# EAGLE design INTP009  product (EAGLE 9.6.2)
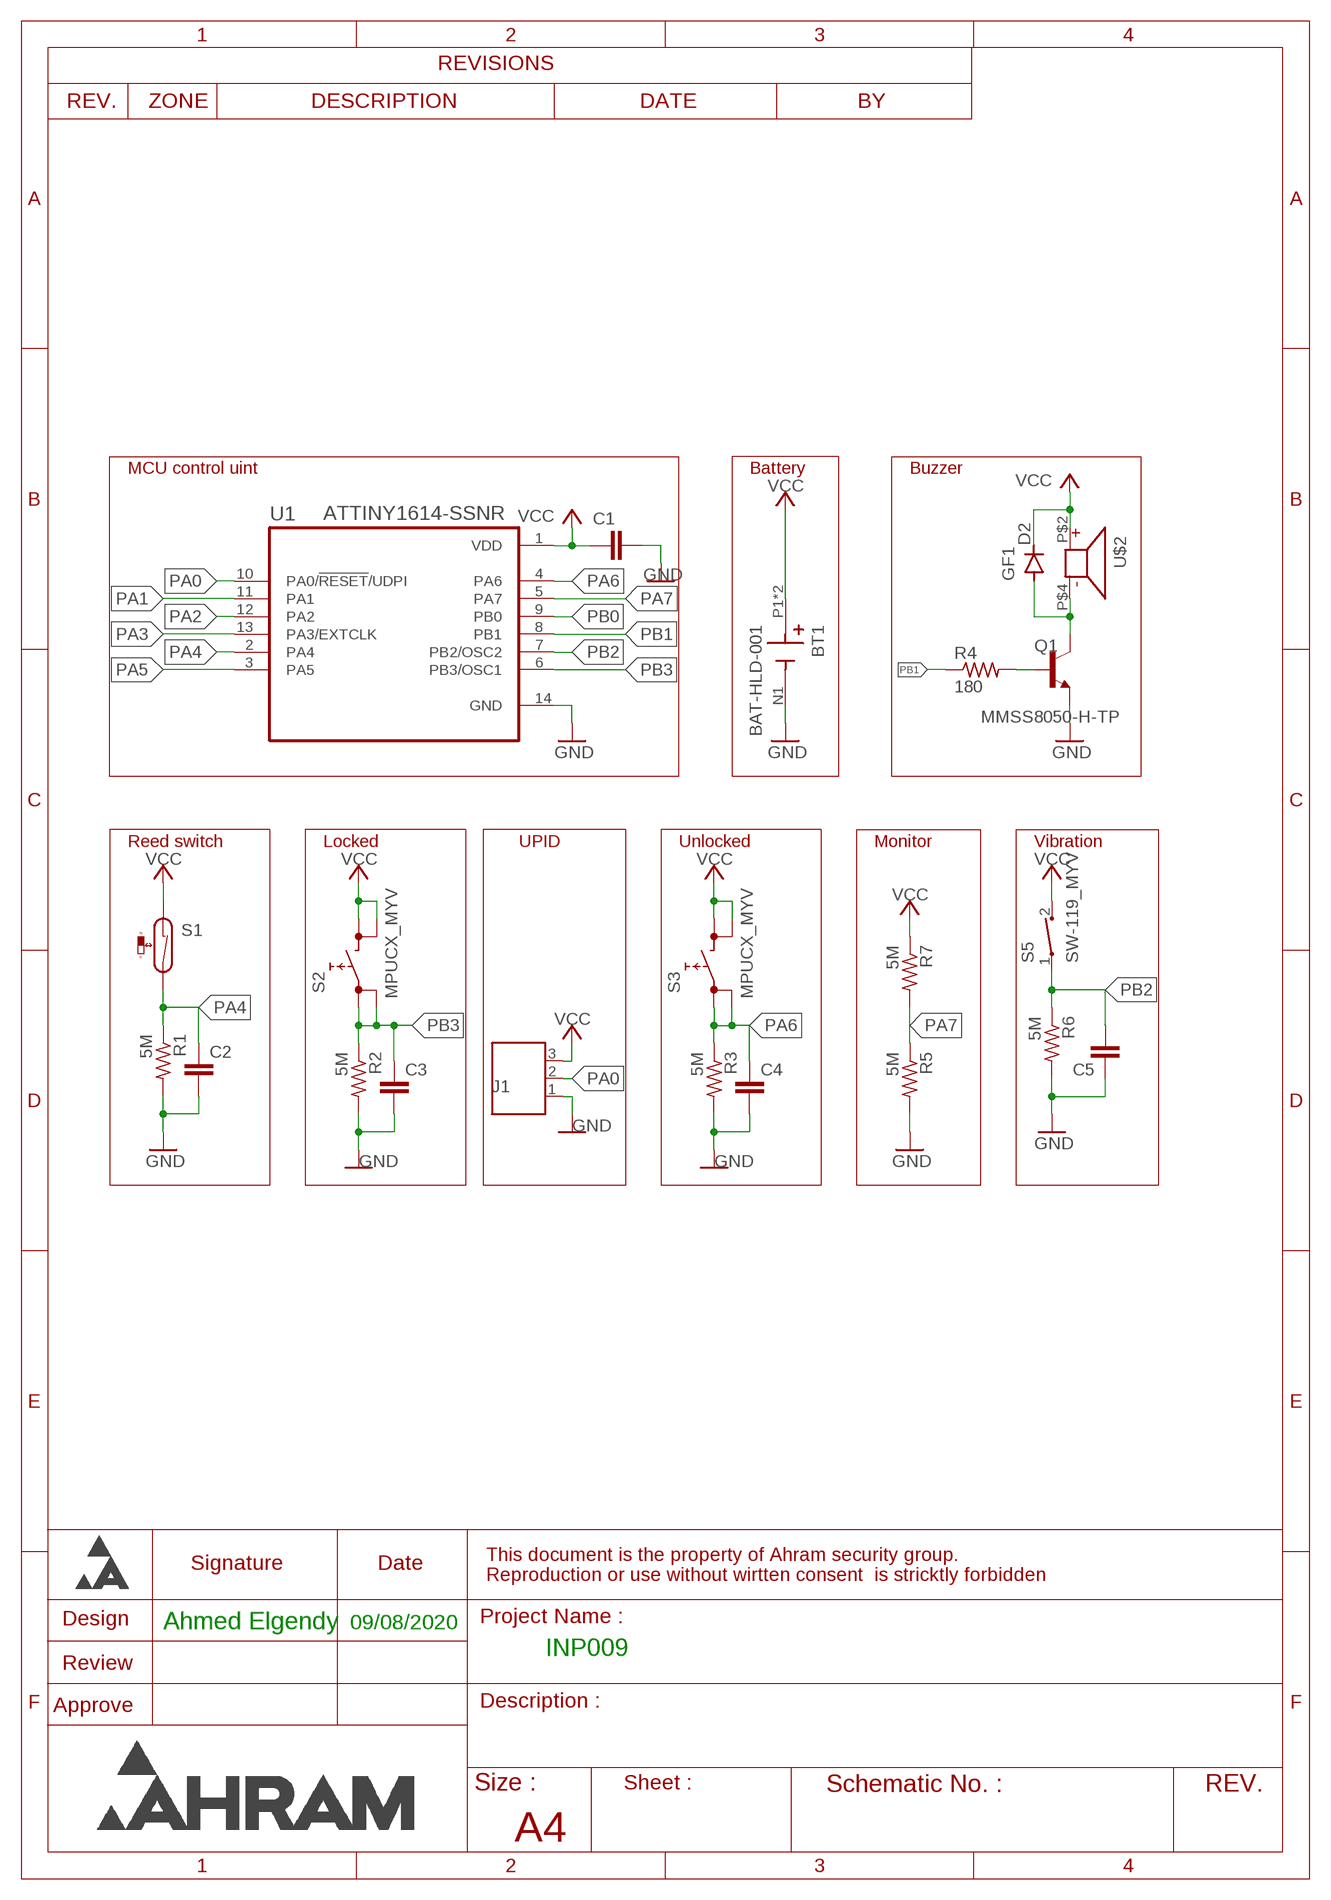
[diagram p0: schematic, sheet 1]

## Parts
BT1  BAT-HLD-001  [BAT_BAT-HLD-001]
C1  C-EUC0805K  [C0805K]
C2  C-EUC0805K  [C0805K]
C3  C-EUC0805K  [C0805K]
C4  C-EUC0805K  [C0805K]
C5  C-EUC0805K  [C0805K]
D2  GF1  [SMA-DO214AC]
J1  691508110303  [691508110303]
Q1  MMSS8050-H-TP  [TRANS_MMSS8050-H-TP]
R1  5M  R-US_M0805  [M0805]
R2  5M  R-US_M0805  [M0805]
R3  5M  R-US_M0805  [M0805]
R4  180  R-US_M0805  [M0805]
R5  5M  R-US_M0805  [M0805]
R6  5M  R-US_M0805  [M0805]
R7  5M  R-US_M0805  [M0805]
S1  RI80SMDM-MYV  [RI80SMDM-0510-J1]
S2  MPUCX_MYV  [MPUCX_MYV]
S3  MPUCX_MYV  [MPUCX_MYV]
S5  SW-119_MYV  [SW-119]
U1  ATTINY1614-SSNR  [SOIC127P600X175-14N]
U$2  ST-A03BH_MYV  [ST-A03BH_MYV]

## Nets
GND: BT1.N1(-) C1.2 C2.2 C3.2 C4.2 C5.1 J1.1 Q1.2(E) R1.2 R2.2 R3.2 R5.2 R6.2 U1.14(GND)
N$2: D2.A Q1.3(C) U$2.P$4
N$4: Q1.1(B) R4.2
PA0: J1.2 U1.10(PA0/!RESET!/UDPI)
PA1: U1.11(PA1)
PA2: U1.12(PA2)
PA3: U1.13(PA3/EXTCLK)
PA4: C2.1 R1.1 S1.P$2 U1.2(PA4)
PA5: U1.3(PA5)
PA6: C4.1 R3.1 S3.1 S3.2 U1.4(PA6)
PA7: R5.1 R7.2 U1.5(PA7)
PB0: U1.9(PB0)
PB1: R4.1 U1.8(PB1)
PB2: C5.2 R6.1 S5.1 U1.7(PB2/OSC2)
PB3: C3.1 R2.1 S2.1 S2.2 U1.6(PB3/OSC1)
VCC: BT1.P1(+) BT1.P2(+) C1.1 D2.K(C) J1.3 R7.1 S1.P$1 S2.3 S2.4 S3.3 S3.4 S5.2 U1.1(VDD) U$2.P$2

## Notes on the sheet
- MCU control uint | Battery | Buzzer
- Reed switch | Locked | UPID | Unlocked | Monitor | Vibration
- Ahmed Elgendy | 09/08/2020
- INP009

## Library data of the parts
BT1 = BAT-HLD-001:BAT-HLD-001: Battery Retainer Coin, 20.0mm 1 Cell SMD (SMT) Tab Buy Part <https://snapeda.com/parts/BAT-HLD-001/Linx%20Technologies/view-part/?ref=eda>; AVAILABILITY: Good; DESCRIPTION: Battery Holder 1 Cells Phosphor Bronze Bulk; DIGIKEY-PURCHASE-URL: https://snapeda.com/shop?store=DigiKey&id=184402; MF: Linx Technologies; MOUSER-PURCHASE-URL: https://snapeda.com/shop?store=Mouser&id=184402; MP: BAT-HLD-001; PACKAGE: None; PRICE: None
C1-C5 = rcl:C-EU: CAPACITOR, European symbol; SPICEPREFIX: C
D2 = diode:GF1: DIODE
J1 = Wurth_Elektronik_Electromechanic_Terminal_Blocks_Connectors_rev16b:691508110303: WR-TBL Terminal block - serie 5081 - 3 Pins;=>Code : Con_TBL_Screw_PClamp_3.50_6915081103xx_691508110303 <http://katalog.we-online.de/media/images/eican/Con_TBL_Screw_PClamp_3.50_6915081103xx_pf2.jpg> Details see: http://katalog.we-online.de/em/datasheet/6915081103xx.pdf Created 11/3/2014, Karrer Zheng 2014 (C) Wurth Elektronik
Q1 = MMSS8050-H-TP:MMSS8050-H-TP: MMSS8050-H Series 25 V 1.5 A NPN Silicon Plastic-Encapsulate Transistor-SOT-23; AVAILABILITY: Unavailable; DESCRIPTION: Bipolar _BJT_ Transistor NPN 25V 1.5A 100MHz 625mW Surface Mount SOT-23; MF: Micro Commercial; MP: MMSS8050-H-TP; PACKAGE: SOT-23 Micro Commercial; PRICE: None
R1-R7 = rcl:R-US_: RESISTOR, American symbol; SPICEPREFIX: R
S1 = reed_MYV:RI80SMDM-MYV
S2 S3 = shouhan_BP:MPUCX_MYV
S5 = sw-119_MYV:SW-119_MYV
U1 = ATTINY1614-SSNR:ATTINY1614-SSNR: 20MHz, SOIC, 85C, Green, 14 SOIC .150in T/R; ARROW_ELECTRONICS-PURCHASE-URL: https://snapeda.com/shop?store=Arrow+Electronics&id=4817174; AVAILABILITY: Unavailable; DESCRIPTION: IC MCU 8BIT 16KB FLASH 14SOIC; DIGIKEY-PURCHASE-URL: https://snapeda.com/shop?store=DigiKey&id=4817174; MF: Microchip Technology; MOUSER-PURCHASE-URL: https://snapeda.com/shop?store=Mouser&id=4817174; MP: ATTINY1614-SSNR; PACKAGE: None; PRICE: None
U$2 = ST-A03BH:ST-A03BH_MYV

## Board
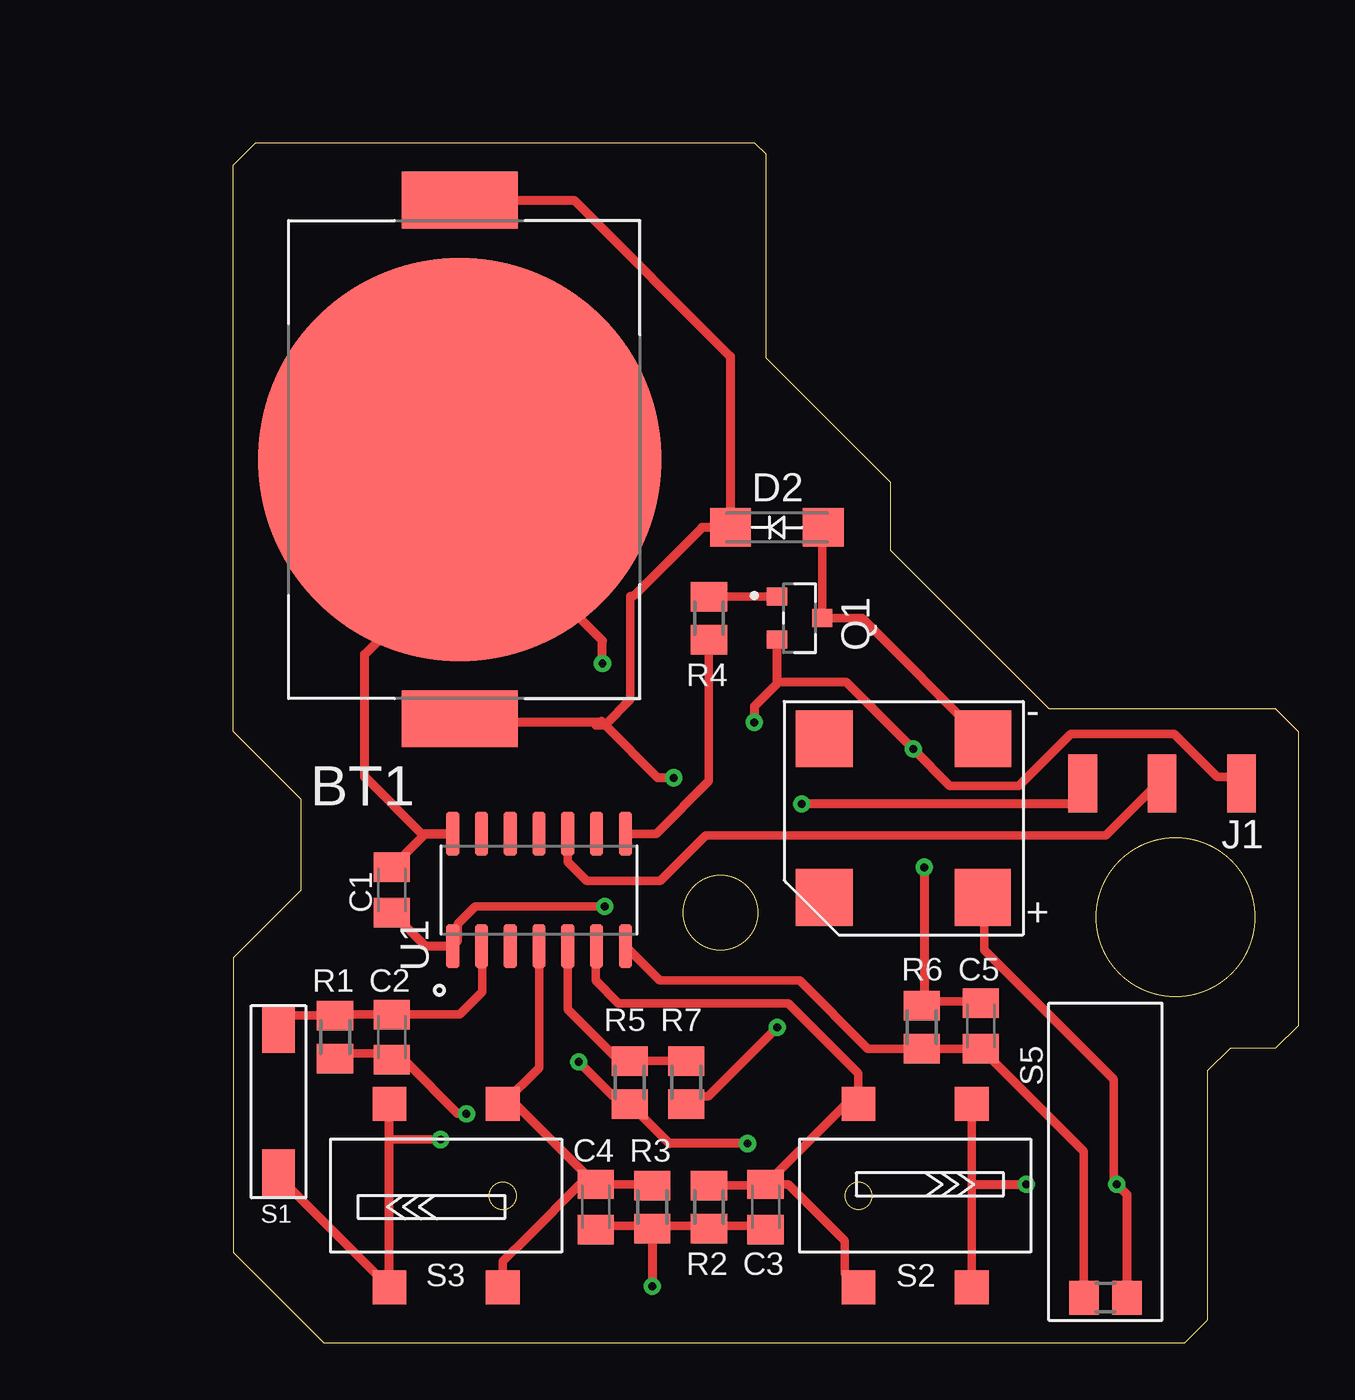
[diagram p1: board, top side]
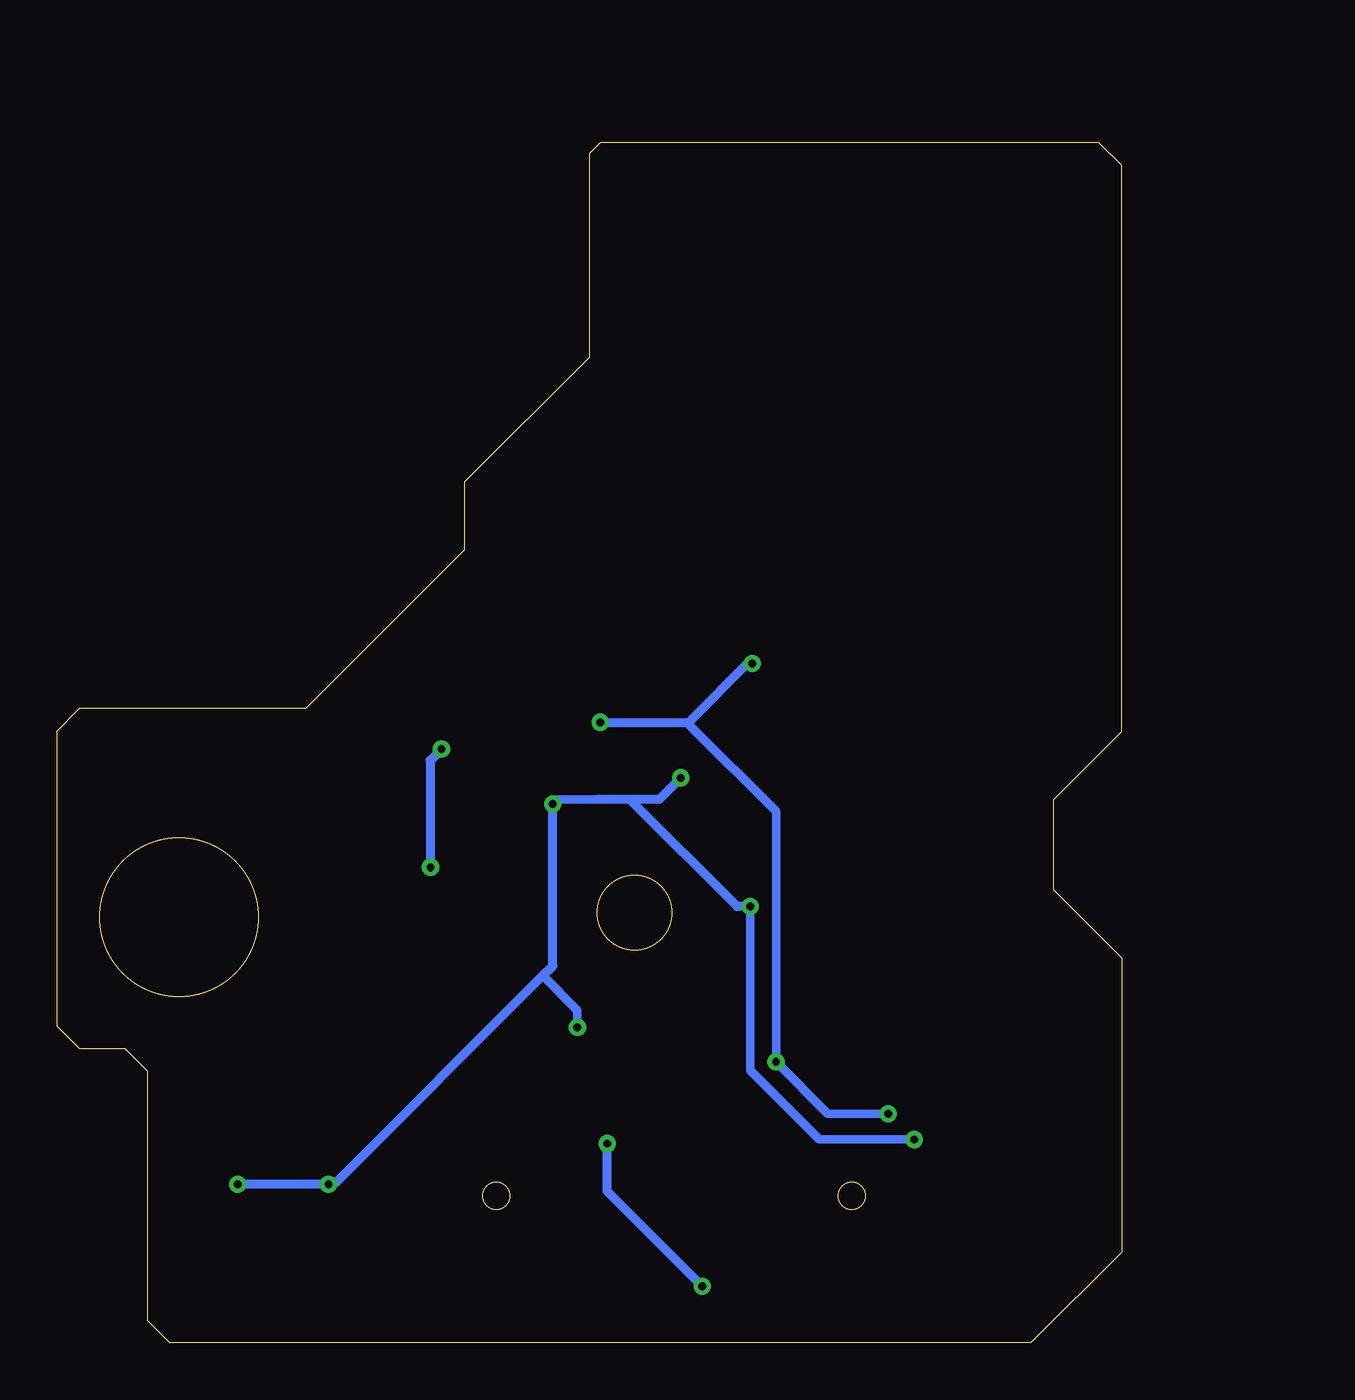
[diagram p2: board, bottom side, seen from below]

Size 47 x 53 mm. Coordinates in mm from the lower left corner, seen from the top.
Outline: 3,20 3,24 0,27 0,52 1,53 23,53 23.5,52.5 23.5,43.5 29,38 29,35 36,28 46,28 47,27 47,14 46,13 44,13 43,12 43,1 42,0 4,0 0,4 0,17 3,20
Outline: circle at 41.6,18.8 radius 3.5
Outline: circle at 21.5,19 radius 1.65
Outline: circle at 27.6,6.5 radius 0.6
Outline: circle at 11.9,6.5 radius 0.6
Copper layers (1*16): Top 0.035mm / dielectric 1.5mm / Bottom 0.035mm
Design rules "default *": minimum track width 15mil, minimum drill 0.35mm, track to track 15mil, track to pad 15mil, pad to pad 15mil, via to via 15mil, smd to smd 15mil, copper to edge 25mil, drill to drill 15mil, minimum pad ring 10mil, minimum via ring 8mil, stop-mask expansion 4mil, vias tented up to drill 0mil, thermal gap 10mil

### Footprints (pad centres in the part's own frame; a part is rotated, then mirrored left to right if it is on the bottom)
BAT_BAT-HLD-001 = smd 17.8 x 17.8: N1 0,0 | smd 2.5 x 5.1: P1 -11.45,0; P2 11.45,0
C0805K = smd 1.3 x 1.6: 1 -1,0; 2 1,0
SMA-DO214AC = smd 1.8 x 1.7: A -2.05,0; K 2.05,0
691508110303 = smd 1.27 x 2.54: 1 -3.5,0; 2 0,0; 3 3.5,0
TRANS_MMSS8050-H-TP = smd 0.9 x 0.8: 1 -1,0.95; 2 -1,-0.95; 3 1,0
M0805 = smd 1.3 x 1.6: 1 -0.95,0; 2 0.95,0
RI80SMDM-0510-J1 = smd 2.1 x 1.45: P$1 -3,0; P$2 3.35,0
MPUCX_MYV = smd 1.5 x 1.5: 1 0.1,1.55; 2 0.1,-6.55; 3 5.1,1.55; 4 5.1,-6.55
SW-119 = smd 1.3 x 1.5: 1 -0.95,0; 2 0.95,0
SOIC127P600X175-14N = smd 1.95 x 0.59: 1 -2.48,3.81; 2 -2.48,2.54; 3 -2.48,1.27; 4 -2.48,0; 5 -2.48,-1.27; 6 -2.48,-2.54; 7 -2.48,-3.81; 8 2.48,-3.81; 9 2.48,-2.54; 10 2.48,-1.27; 11 2.48,0; 12 2.48,1.27; 13 2.48,2.54; 14 2.48,3.81
ST-A03BH_MYV = smd 2.5 x 2.5: P$1 0,0; P$2 7,0; P$3 0,7; P$4 7,7

### Placement (x,y rotation side)
BT1  10,39 90 top
C1  7,20 90 top
C2  7,13.5 270 top
C3  23.5,6 270 top
C4  16,6 270 top
C5  33,14 270 top
D2  24,36 180 top
J1  41,24.7 180 top
Q1  25,32 0 top
R1  4.5,13.5 270 top
R2  21,6 270 top
R3  18.5,6 270 top
R4  21,32 90 top
R5  17.5,11.5 270 top
R6  30.39,13.94 90 top
R7  20,11.5 90 top
S1  2,10.5 90 top
S2  27.5,9 0 top
S3  12,4 180 top
S5  38.5,2 0 top
U1  13.5,20 90 top
U$2  26.09,19.67 0 top

### Tracks (layer width: path | path; a pad name or v marks a point on that pad's centre or on a via)
GND  (via drill 0.35)
  Top 0.381: R1.2 4.58,12.79 6.87,12.79 C2.2 7.25,12.41 7.63,12.41 9.92,10.12 v10.3,10.12 | C3.2 23.25,5.17 21.35,5.17 R2.2 20.97,5.17 18.68,5.17 R3.2 18.3,5.17 16.01,5.17 C4.2 15.63,4.78 | R6.2 30.49,15.07 32.78,15.07 C5.1 | 44.59,24.6 J1.1 44.21,24.98 43.44,24.98 41.54,26.88 36.97,26.88 34.68,24.6 31.63,24.6 v30.02,26.22 | v15.25,12.41 16.77,10.88 17.16,10.88 R5.2 | 14.59,32.71 13.73,31.84 11.06,31.84 11.06,31.9 | 29.67,26.56 27.06,29.17 24.01,29.17 24,29.1 | BT1.N1 9.92,38.69 9.92,31.9 9.92,31.84
  Top 0.406: C1.2 8.48,22.48 U1.14 8.32,22.48 5.8,25 5.8,30.4 7.3,31.9 9.92,31.9 11.06,31.9 11.2,31.9 | Q1.2 24,29.1 23,28.1 v23,27.4 | v16.3,30 16.3,31 14.59,32.71 14.4,32.9 | v22.7,8.8 19.25,8.8 R5.2 | R3.2 v18.5,2.5 | 29.67,26.56 v30.02,26.22 | R6.2 30.5,15 v30.5,21
  Bottom 0.381: 19.1,27.4 19.06,27.26 15.25,23.45 v15.25,12.41 12.96,10.12 v10.3,10.12 | v30.5,21 30.52,21
  Bottom 0.406: v23,27.4 19.1,27.4 16.4,30.1 v16.3,30 | v18.5,2.5 22.7,6.7 v22.7,8.8 | v30.02,26.22 30.52,25.72 30.52,21 30.52,20.91
N$2
  Top 0.381: U$2.P$4 27.76,32 Q1.3 26,35.95 D2.A
N$4
  Top 0.381: Q1.1 R4.2
PA0
  Top 0.381: U1.10 14.77,21.23 15.6,20.4 18.86,20.4 20.86,22.4 38.52,22.4 40.82,24.7 J1.2
PA4
  Top 0.381: S1.P$2 2.6,14.45 R1.1 4.55,14.5 C2.1 10,14.5 11,15.5 11,17.48 U1.2
PA6
  Top 0.381: S3.1 11.9,3.6 12.99,4.69 13,4.69 15.31,7 C4.1 | C4.1 12.45,10.55 S3.2 13.5,12.15 U1.4 | C4.1 18.45,7 R3.1
PA7
  Top 0.381: R7.2 R5.1 17.05,12.45 14.77,14.73 U1.5
PB1
  Top 0.381: U1.8 18.68,22.48 21,24.8 R4.1
PB2
  Top 0.381: S5.1 37.55,8.45 C5.2 R6.1 28.01,12.99 25,16 18.83,16 U1.7
PB3
  Top 0.381: R2.1 23.45,6.95 C3.1 | C3.1 27.05,10.55 S2.1 27.6,11.9 24.5,15 17,15 16,16 16,17.48 U1.6 | S2.2 27,3.05 27,4.5 24.5,7 C3.1
VCC  (via drill 0.35)
  Top 0.381: S2.4 32.6,7 S2.3 | U$2.P$2 33.16,19.64 33.16,17.36 38.87,11.64 38.87,7.07 v39,7 | 10.7,27.26 10.3,27.26 BT1.P1 | v24.01,13.93 20.97,10.88 20.2,10.88 R7.1 | v16.39,19.26 10.68,19.26 9.92,18.5 9.92,17.74 U1.1 | 16.01,27.4 16.01,27.26 16.39,27.26 16.42,27.29 17.54,28.41 17.54,32.98 17.7,33 | v9.15,8.98 6.9,8.98 6.87,8.98
  Top 0.406: C1.1 8.48,17.52 U1.1 | S3.4 6.9,8.98 S3.3 2,7.35 S1.P$1 | 32.6,7 v35,7 | v39,7 39.45,6.55 S5.2 | J1.3 37.5,24.12 37.18,23.8 v25.1,23.8 | BT1.P2 15.05,50.45 21.95,43.55 D2.K 20.7,36 17.7,33 | 16.2,27.4 16.01,27.4 10.7,27.4 10.7,27.26 10.7,27.1 | v19.45,24.95 18.75,24.95 16.42,27.29 16.25,27.45
  Bottom 0.381: v24.01,13.93 24.01,14.69 25.54,16.22 34.68,7.07 v35,7 | v9.15,8.98 13.34,8.98 16.39,12.02 v16.39,19.26 | 23.1,24 25,24 v25.1,23.8 | 21.7,24 21,24
  Bottom 0.406: v35,7 v39,7 | 25.54,16.22 25.1,16.65 v25.1,23.8 | v19.45,24.95 20.4,24 21.7,24 | 21.7,24 23.1,24 | v16.39,19.26 16.96,19.26 21.7,24

### Text on the board
bNames: GENDY / ASG